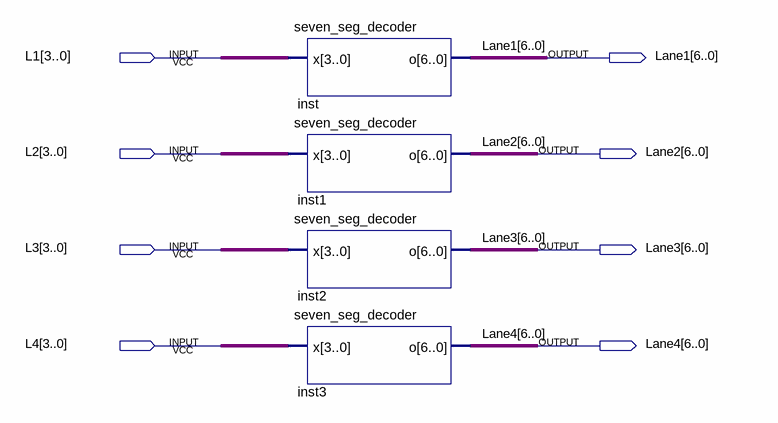
[diagram p0: schematic sheet]
// Quartus schematic sevensegs.bdf as structural Verilog: 4 symbols, 8 pins
module sevensegs (
  input  [3:0] L1,
  input  [3:0] L2,
  input  [3:0] L3,
  input  [3:0] L4,
  output [6:0] Lane1,
  output [6:0] Lane2,
  output [6:0] Lane3,
  output [6:0] Lane4
);

  seven_seg_decoder inst (.x(L1), .o(Lane1));
  seven_seg_decoder inst1 (.x(L2), .o(Lane2));
  seven_seg_decoder inst2 (.x(L3), .o(Lane3));
  seven_seg_decoder inst3 (.x(L4), .o(Lane4));
endmodule
